# EAGLE schematic MRIRspBox20220129 (EAGLE 9.6.2)
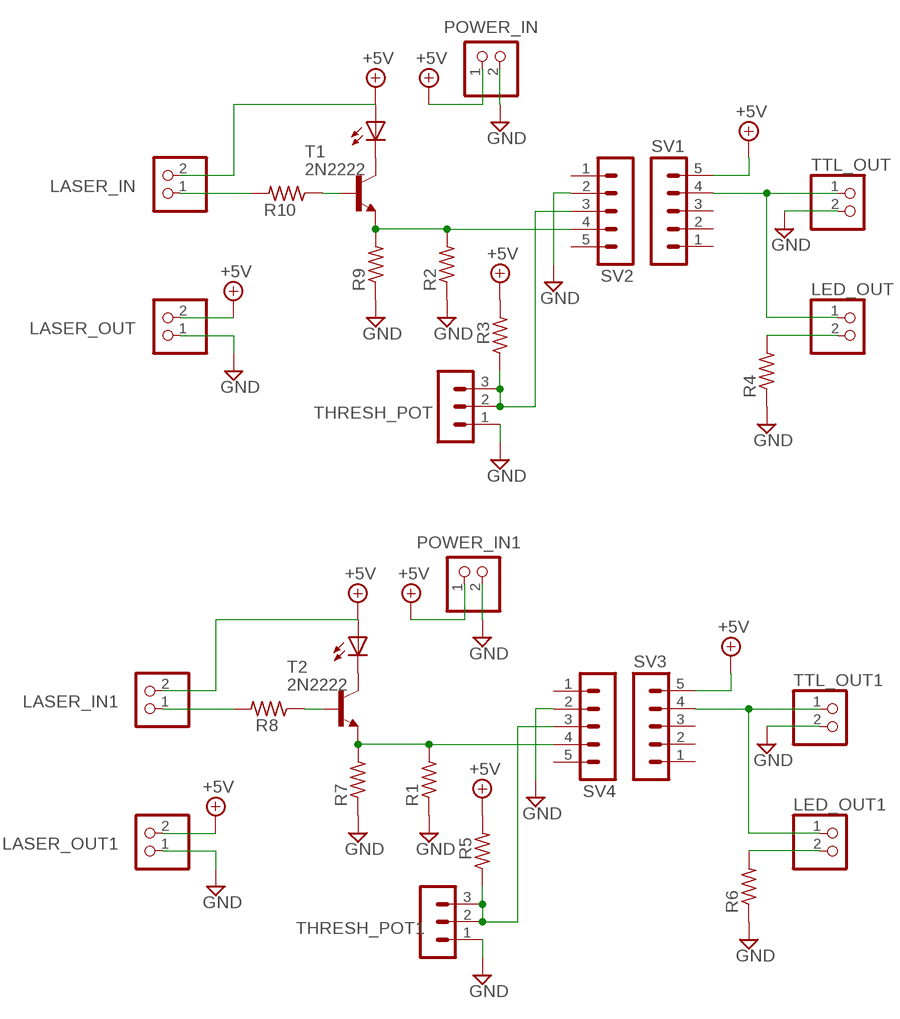
[diagram p0: schematic, sheet 1]

## Parts
LASER_IN  PINHD-1X2  [1X02]
LASER_IN1  PINHD-1X2  [1X02]
LASER_OUT  PINHD-1X2  [1X02]
LASER_OUT1  PINHD-1X2  [1X02]
LED1  LED_ELD260  [LED_LD260]
LED2  LED_ELD260  [LED_LD260]
LED_OUT  PINHD-1X2  [1X02]
LED_OUT1  PINHD-1X2  [1X02]
POWER_IN  PINHD-1X2  [1X02]
POWER_IN1  PINHD-1X2  [1X02]
R1  R-US_0207/12  [0207/12]
R2  R-US_0207/12  [0207/12]
R3  R-US_0207/12  [0207/12]
R4  R-US_0207/12  [0207/12]
R5  R-US_0207/12  [0207/12]
R6  R-US_0207/12  [0207/12]
R7  R-US_0207/12  [0207/12]
R8  R-US_0207/12  [0207/12]
R9  R-US_0207/12  [0207/12]
R10  R-US_0207/12  [0207/12]
SV1  MA05-1  [MA05-1]
SV2  MA05-1  [MA05-1]
SV3  MA05-1  [MA05-1]
SV4  MA05-1  [MA05-1]
T1  2N2222  [TO92-EBC-OVAL]
T2  2N2222  [TO92-EBC-OVAL]
THRESH_POT  MA03-1  [MA03-1]
THRESH_POT1  MA03-1  [MA03-1]
TTL_OUT  PINHD-1X2  [1X02]
TTL_OUT1  PINHD-1X2  [1X02]

## Nets
+5V: LASER_IN1.2 LASER_IN.2 LASER_OUT1.2 LASER_OUT.2 LED1.A LED2.A POWER_IN1.1 POWER_IN.1 R3.2 R5.2 SV1.5 SV3.5
GND: LASER_OUT1.1 LASER_OUT.1 POWER_IN1.2 POWER_IN.2 R1.1 R2.1 R4.1 R6.1 R7.1 R9.1 SV2.2 SV4.2 THRESH_POT1.1 THRESH_POT.1 TTL_OUT1.2 TTL_OUT.2
N$1: LED_OUT1.1 SV3.4 TTL_OUT1.1
N$2: R5.1 SV4.3 THRESH_POT1.2 THRESH_POT1.3
N$3: LED_OUT.1 SV1.4 TTL_OUT.1
N$4: R3.1 SV2.3 THRESH_POT.2 THRESH_POT.3
N$5: LED_OUT1.2 R6.2
N$6: LASER_IN1.1 R8.2
N$7: LED_OUT.2 R4.2
N$8: R8.1 T2.B
N$9: LED2.K(C) T2.C
N$10: R1.2 R7.2 SV4.4 T2.E
N$11: LASER_IN.1 R10.2
N$12: R10.1 T1.B
N$13: LED1.K(C) T1.C
N$14: R2.2 R9.2 SV2.4 T1.E
Unconnected: SV1.1 SV1.2 SV1.3 SV2.1 SV2.5 SV3.1 SV3.2 SV3.3 SV4.1 SV4.5

## Library data of the parts
LASER_IN LASER_IN1 LASER_OUT LASER_OUT1 LED_OUT LED_OUT1 POWER_IN POWER_IN1 TTL_OUT TTL_OUT1 = pinhead:PINHD-1X2: PIN HEADER
LED1 LED2 = eagle-ltspice:LED_E: LED Source: http://www.osram.convergy.de Source: www.luxeon.com Source: www.kingbright.com; SPICEMODEL: NONE; SPICEPREFIX: D; SPICETYPE: diode
R1-R10 = adafruit:R-US_: RESISTOR, American symbol
SV1-SV4 = con-lstb:MA05-1: PIN HEADER; OC_FARNELL: unknown; OC_NEWARK: unknown
T1 T2 = adafruit:2N2222: NPN TRANSISTOR Big oval pads
THRESH_POT THRESH_POT1 = con-lstb:MA03-1: PIN HEADER; OC_FARNELL: unknown; OC_NEWARK: unknown